# EAGLE design CanBus-UP-Schalter-Teil1 (EAGLE 7.4.0)
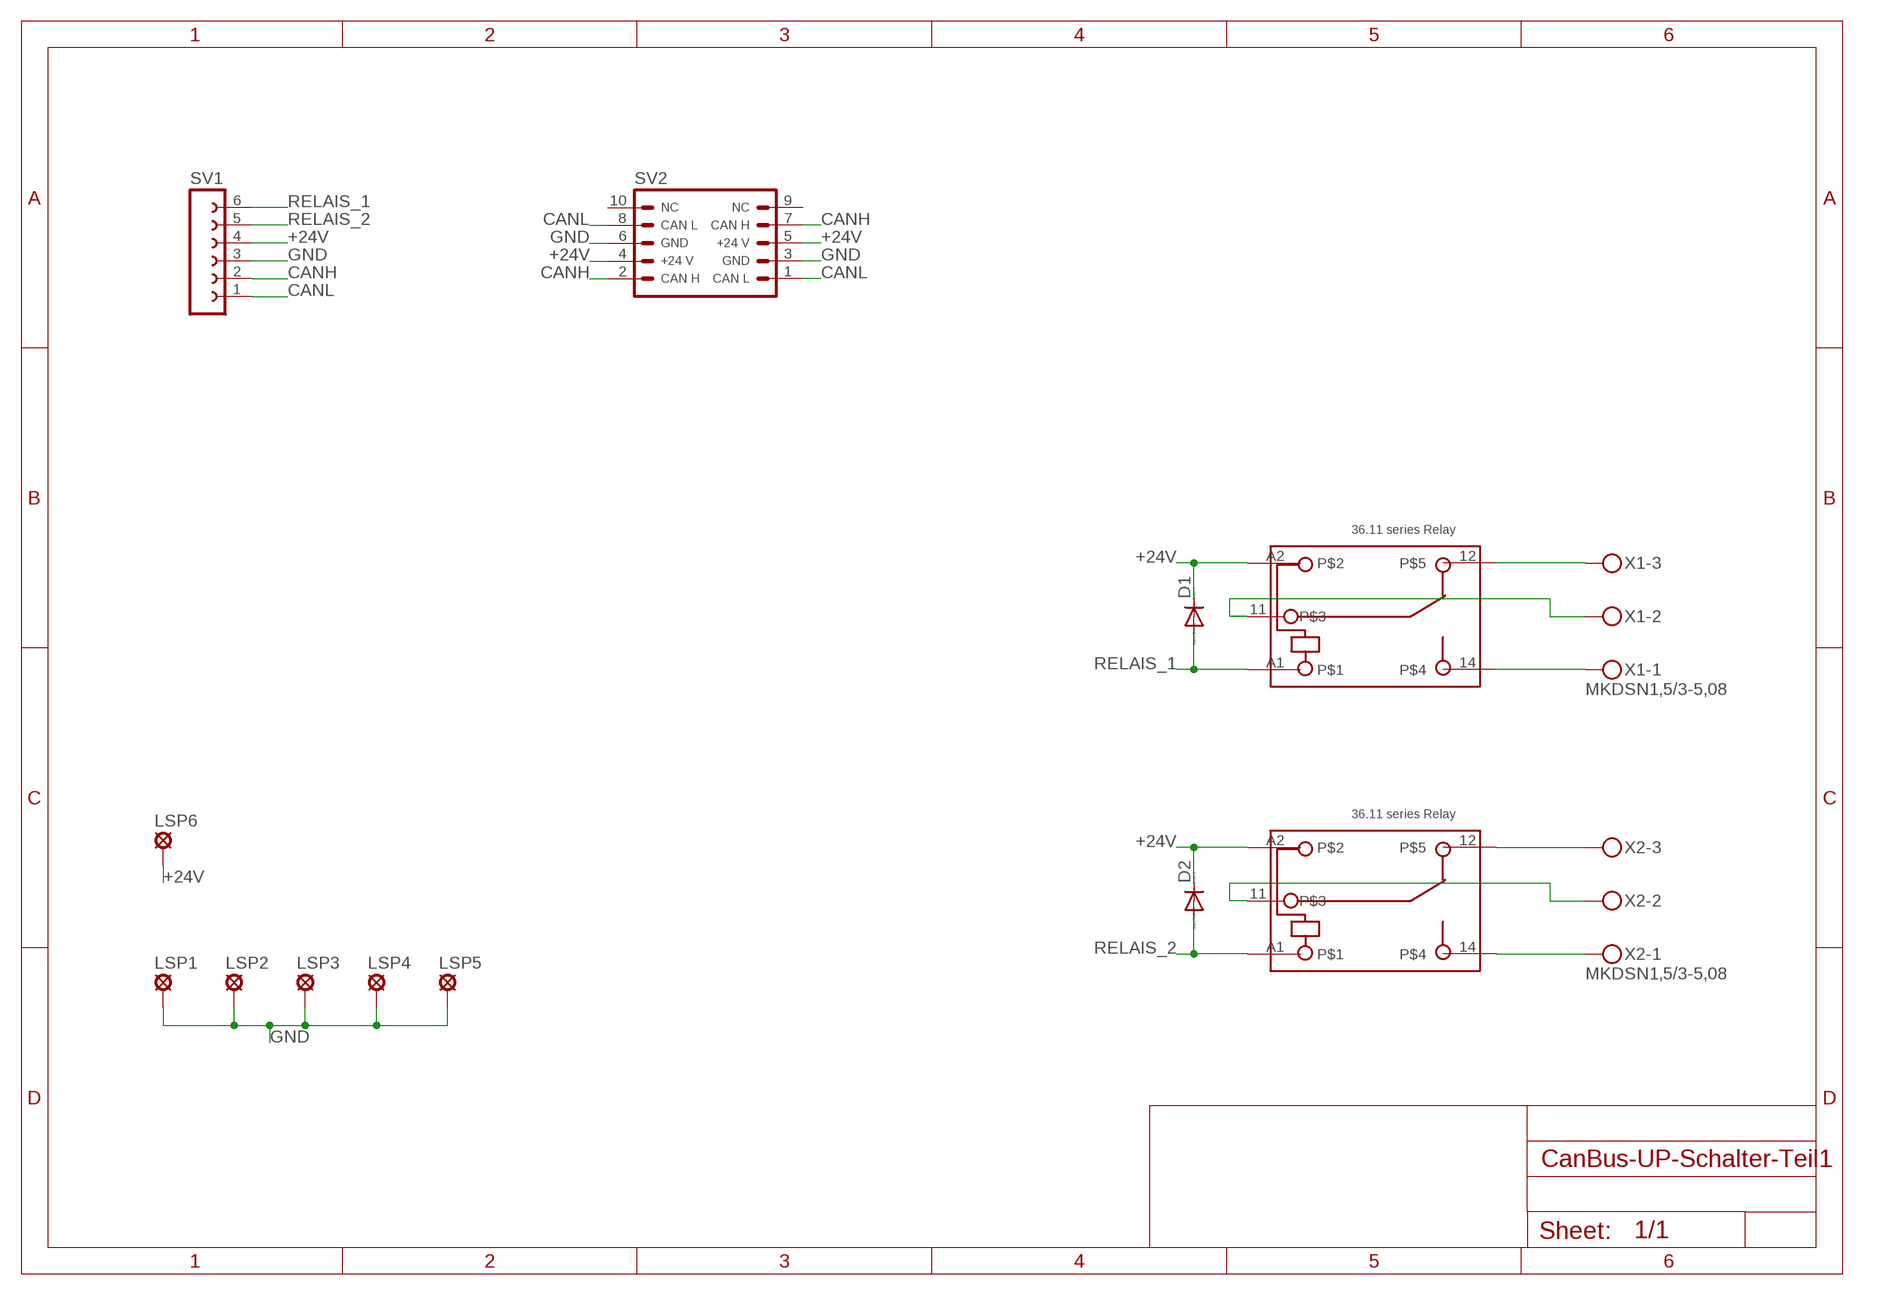
[diagram p0: schematic, sheet 1]

## Parts
D1  DIODE-SOD323-R  [SOD323-R]
D2  DIODE-SOD323-R  [SOD323-R]
K1  36.11  [36.11]
K2  36.11  [36.11]
LSP1  LSP13  [LSP13]
LSP2  LSP13  [LSP13]
LSP3  LSP13  [LSP13]
LSP4  LSP13  [LSP13]
LSP5  LSP13  [LSP13]
LSP6  LSP13  [LSP13]
SV1  FE06-1  [FE06]
SV2  ML10L  [ML10L]
X1  MKDSN1,5/3-5,08  [MKDSN1,5/3-5,08]
X2  MKDSN1,5/3-5,08  [MKDSN1,5/3-5,08]

## Nets
+24V: D1.C D2.C K1.A2 K2.A2 LSP6.MP SV1.4 SV2.4 SV2.5
CANH: SV1.2 SV2.2 SV2.7
CANL: SV1.1 SV2.1 SV2.8
GND: LSP1.MP LSP2.MP LSP3.MP LSP4.MP LSP5.MP SV1.3 SV2.3 SV2.6
N$1 [230V]: K1.12 X1.3
N$2 [230V]: K1.14 X1.1
N$3 [230V]: K1.11 X1.2
N$4 [230V]: K2.12 X2.3
N$5 [230V]: K2.14 X2.1
N$6 [230V]: K2.11 X2.2
RELAIS_1: D1.A K1.A1 SV1.6
RELAIS_2: D2.A K2.A1 SV1.5
Unconnected: SV2.9 SV2.10

## Library data of the parts
D1 D2 = diode:DIODE-: DIODE
K1 K2 = relay_finder_36_11:36.11: Printed circuit mount miniature 10 A relay one pole changeover contacts Conform RoHS
LSP1-LSP6 = solpad:LSP13: SOLDER PAD drill 1.3 mm, distributor Buerklin, 12H562
SV1 = con-lsta:FE06-1: FEMALE HEADER; OC_FARNELL: unknown; OC_NEWARK: unknown
SV2 = can-bus:ML10: HARTING; OC_FARNELL: unknown; OC_NEWARK: unknown
X1 X2 = con-phoenix-508:MKDSN1,5/3-5,08: MKDSN 1,5/ 3-5,08 Printklemme Nennstrom: 13,5 A Nennspannung: 250 V Rastermaß: 5,08 mm Polzahl: 3 Anschlussart: Schraubanschluss Montage: Löten Anschlussrichtung Leiter/Platine: 0 ° Artikelnummer: 1729131 Source: http://eshop.phoenixcontact.com .. 1729131.pdf

## Net classes
1 230V: width 2.54 mm, clearance 2.54 mm

## Board
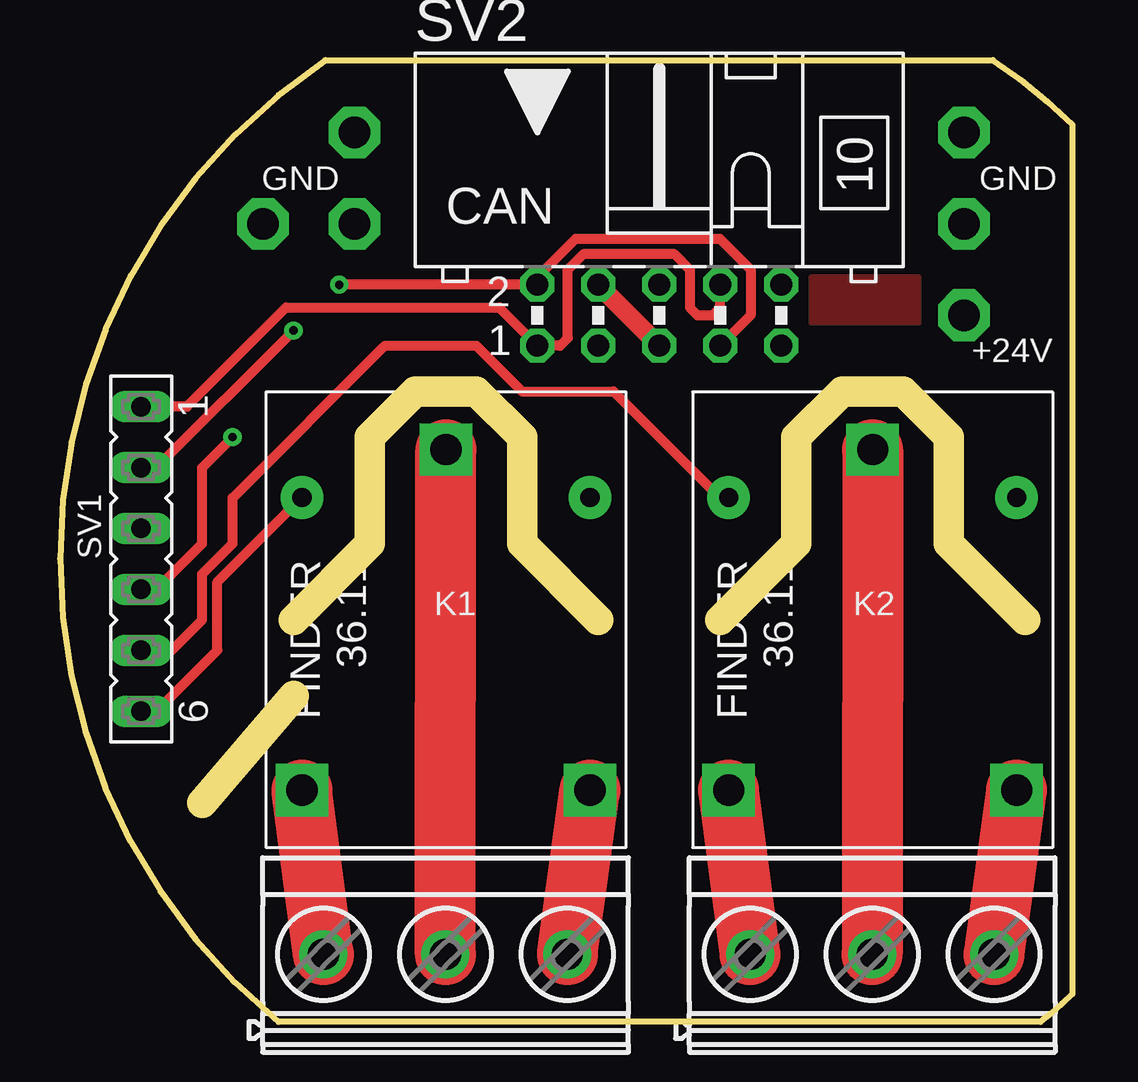
[diagram p1: board, top side]
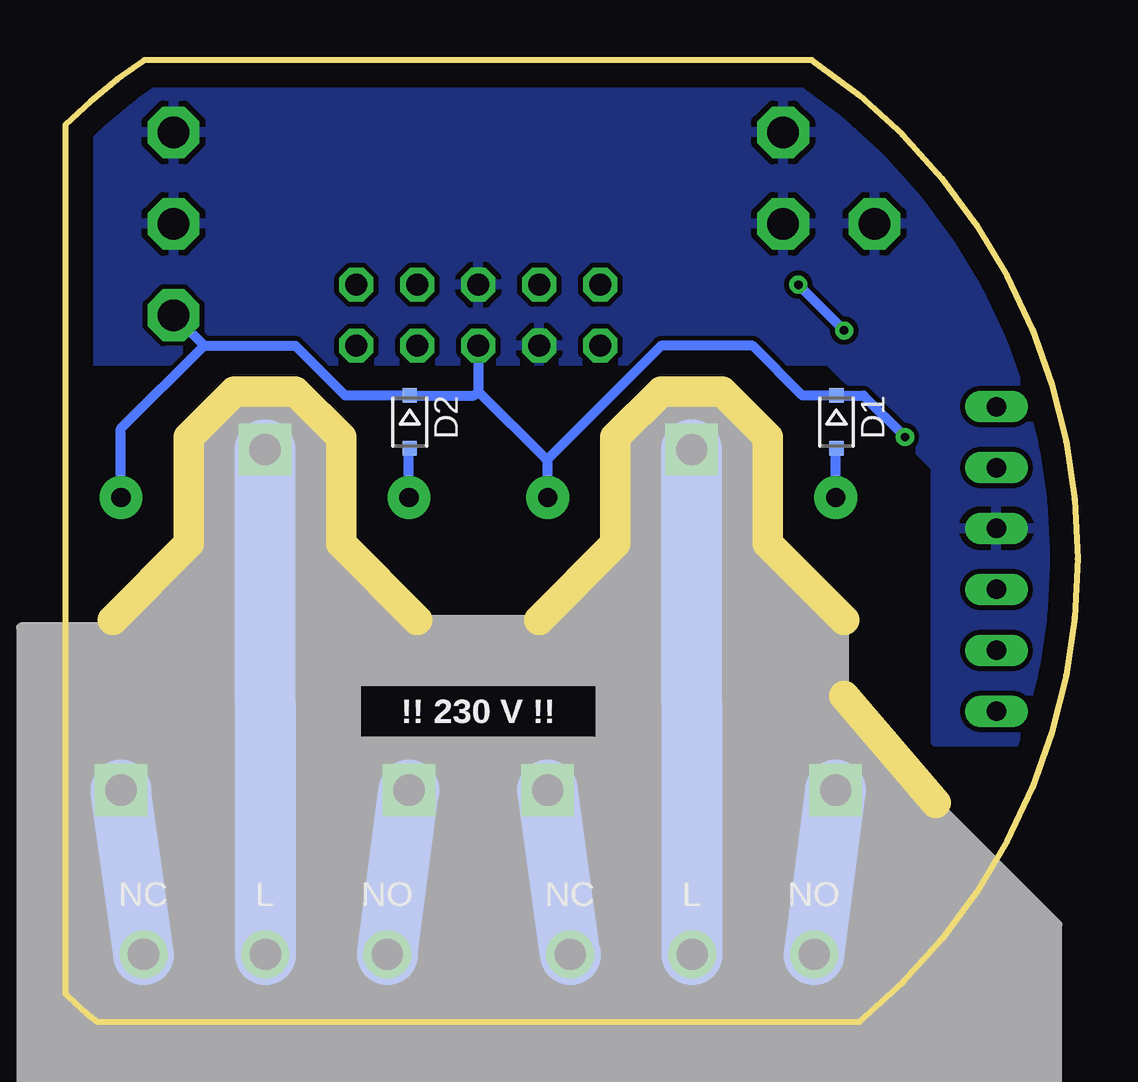
[diagram p2: board, bottom side, seen from below]

Size 42.18 x 40.1 mm. Coordinates in mm from the lower left corner, seen from the top.
Outline: 11.07,40.1 arc106 9.1,0 40.85,0 arc6 42.18,1.17 42.18,37.4 arc11 38.87,40.1 11.07,40.1
Copper layers (1*16): Top 0.035mm / dielectric 1.5mm / Bottom 0.035mm
Design rules "allpcb2 *": minimum track width 8mil, minimum drill 0.5mm, track to track 8mil, track to pad 8mil, pad to pad 8mil, via to via 8mil, smd to smd 6mil, copper to edge 40mil, drill to drill 8mil, minimum pad ring 10mil, minimum via ring 8mil, stop-mask expansion 0.1mm, vias tented up to drill 0.5mm, thermal gap 10mil
Milling: 15 lines

### Footprints (pad centres in the part's own frame; a part is rotated, then mirrored left to right if it is on the bottom)
SOD323-R = smd 0.6 x 0.6: A 1.1,0; C -1.1,0
36.11 = drill 1.3 pad 2.184 square: 11 -7.1,0; 12 7.1,6; 14 7.1,-6 | drill 0.8 pad 1.778: A1 -5.1,-6; A2 -5.1,6
LSP13 = drill 1.321 pad 2.159 octagon: MP 0,0
FE06 = drill 0.813 long: 1 -6.35,0; 2 -3.81,0; 3 -1.27,0; 4 1.27,0; 5 3.81,0; 6 6.35,0
ML10L = drill 0.914 octagon: 1 -5.08,-1.27; 2 -5.08,1.27; 3 -2.54,-1.27; 4 -2.54,1.27; 5 0,-1.27; 6 0,1.27; 7 2.54,-1.27; 8 2.54,1.27; 9 5.08,-1.27; 10 5.08,1.27
MKDSN1,5/3-5,08 = drill 1.3 pad 2: 1 -7.641,0.025; 2 -2.561,0.025; 3 2.519,0.025

### Placement (x,y rotation side)
D1  10.05,25.02 270 bottom
D2  27.83,25.02 270 bottom
K1  16.08,16.76 270 top
K2  33.86,16.76 270 top
LSP1  12.27,33.27 0 top
LSP2  8.46,33.27 0 top
LSP3  12.27,37.08 0 top
LSP4  37.67,33.27 0 top
LSP5  37.67,37.08 0 top
LSP6  37.67,29.46 0 top
SV1  3.38,19.3 270 top
SV2  24.97,29.46 0 top
X1  18.62,2.79 0 top
X2  36.4,2.79 0 top

### Tracks (layer width: path | path; a pad name or v marks a point on that pad's centre or on a via)
+24V  (via drill 0.35 pad 0.7)
  Top 0.406: SV1.4 4.02,18.03 5.92,19.94 5.92,23.11 v7.19,24.38
  Top 0.813: SV2.4 SV2.5
  Bottom 0.406: 22.08,23.46 17.35,28.19 13.54,28.19 11.47,26.12 D1.C 8.93,26.12 v7.19,24.38 | K1.A2 22.08,23.46 | K2.A2 39.86,24.73 36.4,28.19 | 36.4,28.19 32.59,28.19 30.52,26.12 D2.C 25.14,26.12 24.97,26.29 | SV2.5 24.97,26.29 | 22.08,23.46 22.15,23.46 24.97,26.29 | 36.4,28.19 LSP6.MP
BOT
  pour Bottom: 31.32,31.05 35.77,31.05 35.77,29.15 31.32,29.15
CANH  (via drill 0.35 pad 0.7)
  Top 0.406: SV2.7 28.78,29.46 28.78,31.37 27.51,32.64 21.48,32.64 19.89,31.05 SV2.2 v11.64,30.73 | SV1.2 4.02,23.11 v9.73,28.83
  Bottom 0.406: v11.64,30.73 v9.73,28.83
CANL
  Top 0.406: SV2.8 27.51,29.78 27.19,29.46 26.56,29.46 26.24,29.78 26.24,31.37 25.61,32 21.8,32 21.16,31.37 21.16,28.51 20.84,28.19 SV2.1 18.3,29.78 9.41,29.78 5.29,25.65 SV1.1
GND
  pour Bottom: -4.24,11.68 5.92,11.68 5.92,23.11 10.37,27.56 44.02,27.56 44.02,45.97 11,45.97 -4.24,30.73
N$1
  Top 2.54: X1.3 K1.12
  Bottom 2.54: X1.3 K1.12
N$2
  Top 2.54: X1.1 K1.14
  Bottom 2.54: X1.1 K1.14
N$3
  Top 2.54: X1.2 K1.11
  Bottom 2.54: X1.2 K1.11
N$4
  Top 2.54: X2.3 K2.12
  Bottom 2.54: X2.3 K2.12
N$5
  Top 2.54: X2.1 K2.14
  Bottom 2.54: X2.1 K2.14
N$6
  Top 2.54: K2.11 X2.2
  Bottom 2.54: K2.11 X2.2
RELAIS_1
  Top 0.406: SV1.6 4.02,12.95 6.56,15.49 6.56,18.34 K1.A1
  Bottom 0.406: K1.A1 10.08,23.63 D1.A
RELAIS_2
  Top 0.406: SV1.5 4.65,15.49 5.92,16.76 5.92,18.67 7.19,19.94 7.19,21.84 13.54,28.19 17.35,28.19 19.26,26.29 23.07,26.29 27.51,21.84 27.84,21.84 K2.A1
  Bottom 0.406: K2.A1 27.86,23.89 D2.A
TOP
  pour Top: 31.32,31.05 35.77,31.05 35.77,29.15 31.32,29.15

### Text on the board
tPlace: GND | GND
bPlace: !! 230 V !! | NO | L | NC | NO | L | NC
tNames: +24V
tRestrict: TOP
bRestrict: BOT